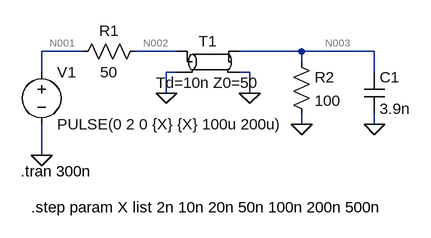
[diagram p0: schematic linea.asc]
linea.asc, the LTspice schematic file:
Version 4
SHEET 1 880 680
WIRE -16 144 -80 144
WIRE 128 144 64 144
WIRE 320 144 224 144
WIRE 432 144 320 144
WIRE 320 160 320 144
WIRE -80 176 -80 144
WIRE 128 176 112 176
WIRE 240 176 224 176
WIRE 432 176 432 144
WIRE 112 208 112 176
WIRE 240 208 240 176
WIRE 320 256 320 240
WIRE 432 256 432 240
WIRE -80 304 -80 256
FLAG 112 208 0
FLAG 240 208 0
FLAG -80 304 0
FLAG 320 256 0
FLAG 432 256 0
SYMBOL voltage -80 160 R0
WINDOW 123 0 0 Left 2
WINDOW 39 24 124 Left 2
SYMATTR InstName V1
SYMATTR Value PULSE(0 2 0 {X} {X} 100u 200u)
SYMBOL res 304 144 R0
SYMATTR InstName R2
SYMATTR Value 100
SYMBOL tline 176 160 R0
SYMATTR InstName T1
SYMATTR Value Td=10n Z0=50
SYMBOL res 80 128 R90
WINDOW 0 0 56 VBottom 2
WINDOW 3 32 56 VTop 2
SYMATTR InstName R1
SYMATTR Value 50
SYMBOL cap 416 176 R0
SYMATTR InstName C1
SYMATTR Value 3.9n
TEXT -112 328 Left 2 !.tran 300n
TEXT -96 384 Left 2 !.step param X list 2n 10n 20n 50n 100n 200n 500n

The netlist it stands for:
* linea.asc
V1 N001 0 PULSE(0 2 0 {X} {X} 100u 200u)
R2 N003 0 100
T1 N002 0 N003 0 Td=10n Z0=50
R1 N002 N001 50
C1 N003 0 3.9n
.tran 300n
.step param X list 2n 10n 20n 50n 100n 200n 500n
.backanno
.end

* Results of the author's LTspice run, read from the files saved beside the schematic
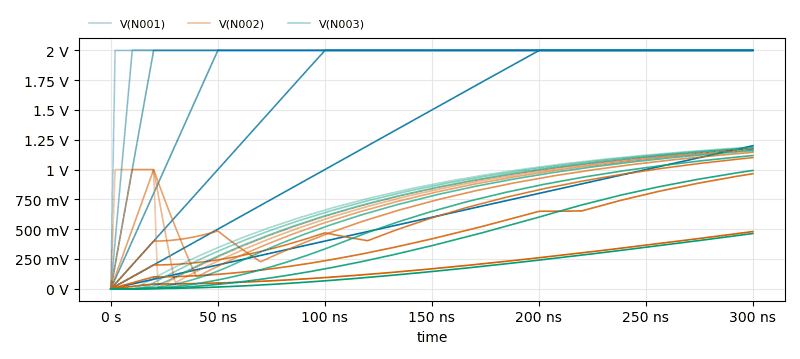
[diagram p1: Transient Analysis of linea.asc, plotted from the saved traces]
* Transient Analysis, 7 runs:
*   V(N001) [x=2e-009]: min 0 V, max 2 V, average 1.993 V, rms 1.997 V, last 2 V
*   V(N001) [x=1e-008]: min 0 V, max 2 V, average 1.967 V, rms 1.983 V, last 2 V
*   V(N001) [x=2e-008]: min 0 V, max 2 V, average 1.933 V, rms 1.956 V, last 2 V
*   V(N001) [x=5e-008]: min 0 V, max 2 V, average 1.833 V, rms 1.886 V, last 2 V
*   V(N001) [x=1e-007]: min 0 V, max 2 V, average 1.667 V, rms 1.764 V, last 2 V
*   V(N001) [x=2e-007]: min 0 V, max 2 V, average 1.333 V, rms 1.491 V, last 2 V
*   V(N001) [x=5e-007]: min 0 V, max 1.2 V, average 600 mV, rms 693.9 mV, last 1.2 V
*   V(N002) [x=2e-009]: min 0 V, max 1.177 V, average 795.9 mV, rms 859.2 mV, last 1.177 V
*   V(N002) [x=1e-008]: min 0 V, max 1.173 V, average 780.3 mV, rms 846 mV, last 1.173 V
*   V(N002) [x=2e-008]: min 0 V, max 1.166 V, average 760.9 mV, rms 823.3 mV, last 1.166 V
*   V(N002) [x=5e-008]: min 0 V, max 1.145 V, average 703.5 mV, rms 768.4 mV, last 1.145 V
*   V(N002) [x=1e-007]: min 0 V, max 1.1 V, average 611.7 mV, rms 689.3 mV, last 1.1 V
*   V(N002) [x=2e-007]: min 0 V, max 965.5 mV, average 448.3 mV, rms 533.4 mV, last 965.5 mV
*   V(N002) [x=5e-007]: min 0 V, max 480.2 mV, average 196.6 mV, rms 241.6 mV, last 480.2 mV
*   V(N003) [x=2e-009]: min 0 V, max 1.189 V, average 768.7 mV, rms 848 mV, last 1.189 V
*   V(N003) [x=1e-008]: min 0 V, max 1.184 V, average 752.9 mV, rms 836.8 mV, last 1.184 V
*   V(N003) [x=2e-008]: min 0 V, max 1.178 V, average 733.3 mV, rms 822.5 mV, last 1.178 V
*   V(N003) [x=5e-008]: min 0 V, max 1.159 V, average 675.3 mV, rms 778.1 mV, last 1.159 V
*   V(N003) [x=1e-007]: min 0 V, max 1.118 V, average 582 mV, rms 699.5 mV, last 1.118 V
*   V(N003) [x=2e-007]: min 0 V, max 992.8 mV, average 414.3 mV, rms 530.9 mV, last 992.8 mV
*   V(N003) [x=5e-007]: min 0 V, max 463.9 mV, average 173 mV, rms 225.9 mV, last 463.9 mV